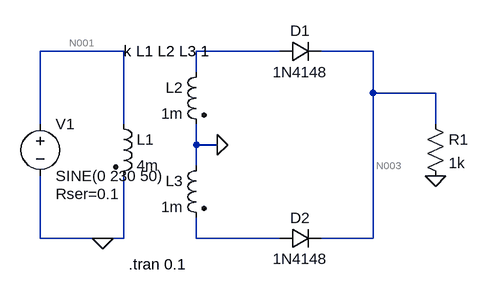
[diagram p0: schematic fullwave_rectifier eclab4.asc]
fullwave_rectifier eclab4.asc, the LTspice schematic file:
Version 4
SHEET 1 880 680
WIRE 128 -16 0 -16
WIRE 368 -16 240 -16
WIRE 512 -16 432 -16
WIRE 240 16 240 -16
WIRE 512 48 512 -16
WIRE 608 48 512 48
WIRE 0 96 0 -16
WIRE 128 96 128 -16
WIRE 608 96 608 48
WIRE 240 128 240 96
WIRE 272 128 240 128
WIRE 240 160 240 128
WIRE 0 272 0 176
WIRE 96 272 0 272
WIRE 128 272 128 176
WIRE 128 272 96 272
WIRE 240 272 240 240
WIRE 368 272 240 272
WIRE 512 272 512 48
WIRE 512 272 432 272
FLAG 96 272 0
FLAG 608 176 0
FLAG 272 128 0
SYMBOL voltage 0 80 R0
WINDOW 123 0 0 Left 0
WINDOW 39 24 124 Left 2
SYMATTR InstName V1
SYMATTR Value SINE(0 230 50)
SYMATTR SpiceLine Rser=0.1
SYMBOL ind2 112 80 R0
SYMATTR InstName L1
SYMATTR Value 4m
SYMATTR Type ind
SYMBOL ind2 256 0 M0
SYMATTR InstName L2
SYMATTR Value 1m
SYMATTR Type ind
SYMBOL diode 368 0 R270
WINDOW 0 32 32 VTop 2
WINDOW 3 0 32 VBottom 2
SYMATTR InstName D1
SYMATTR Value 1N4148
SYMBOL diode 368 288 R270
WINDOW 0 32 32 VTop 2
WINDOW 3 0 32 VBottom 2
SYMATTR InstName D2
SYMATTR Value 1N4148
SYMBOL ind2 256 144 M0
SYMATTR InstName L3
SYMATTR Value 1m
SYMATTR Type ind
SYMBOL res 592 80 R0
SYMATTR InstName R1
SYMATTR Value 1k
TEXT 128 -16 Left 2 !k L1 L2 L3 1
TEXT 136 312 Left 2 !.tran 0.1

The netlist it stands for:
* fullwave_rectifier eclab4.asc
V1 N001 0 SINE(0 230 50) Rser=0.1
L1 N001 0 4m
L2 N002 0 1m
D1 N002 N003 1N4148
D2 N004 N003 1N4148
L3 0 N004 1m
R1 N003 0 1k
.model D D
.lib standard.dio
k L1 L2 L3 1
.tran 0.1
.backanno
.end

* Results of the author's LTspice run, read from the files saved beside the schematic
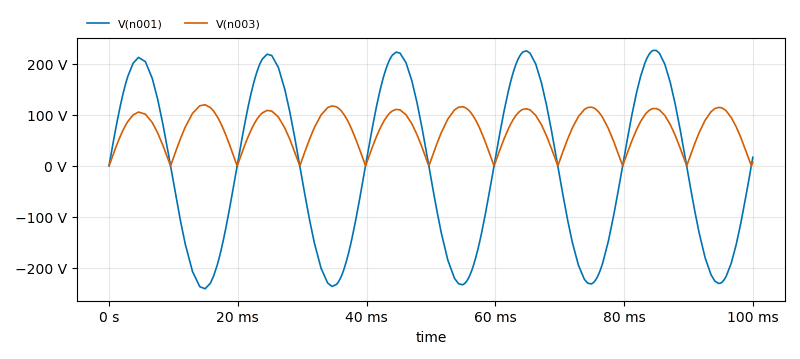
[diagram p1: Transient Analysis of fullwave_rectifier eclab4.asc, plotted from the saved traces]
* Transient Analysis, 1 run:
*   V(n001): min -241.4 V, max 226.5 V, average -6.662 V, rms 161.3 V, last 16.69 V
*   V(n003): min 0 V, max 119.8 V, average 71.51 V, rms 79.9 V, last 7.665 V